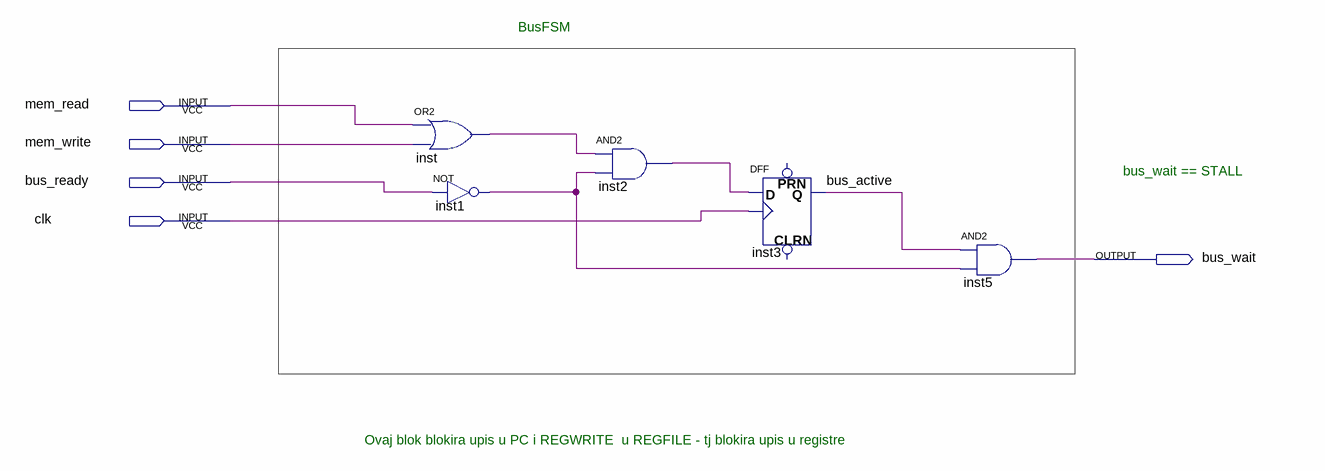
[diagram p0: schematic sheet]
// Quartus schematic BusFSM.bdf as structural Verilog: 5 symbols, 5 pins
module BusFSM (
  input  mem_read,
  input  mem_write,
  input  bus_ready,
  input  clk,
  output bus_wait
);

  wire bus_active, inst1_out, inst2_out, inst_out;

  or inst (inst_out, mem_read, mem_write);
  not inst1 (inst1_out, bus_ready);
  and inst2 (inst2_out, inst_out, inst1_out);
  DFF inst3 (.CLK(clk), .D(inst2_out), .Q(bus_active));  // open: CLRN, PRN
  and inst5 (bus_wait, bus_active, inst1_out);

  // Notes on the sheet:
  //   BusFSM
  //   bus_wait == STALL
  //   Ovaj blok blokira upis u PC i REGWRITE  u REGFILE - tj blokira upis u registre
endmodule
